# EAGLE schematic CanarySchematic3.0 (EAGLE 8.4.1)
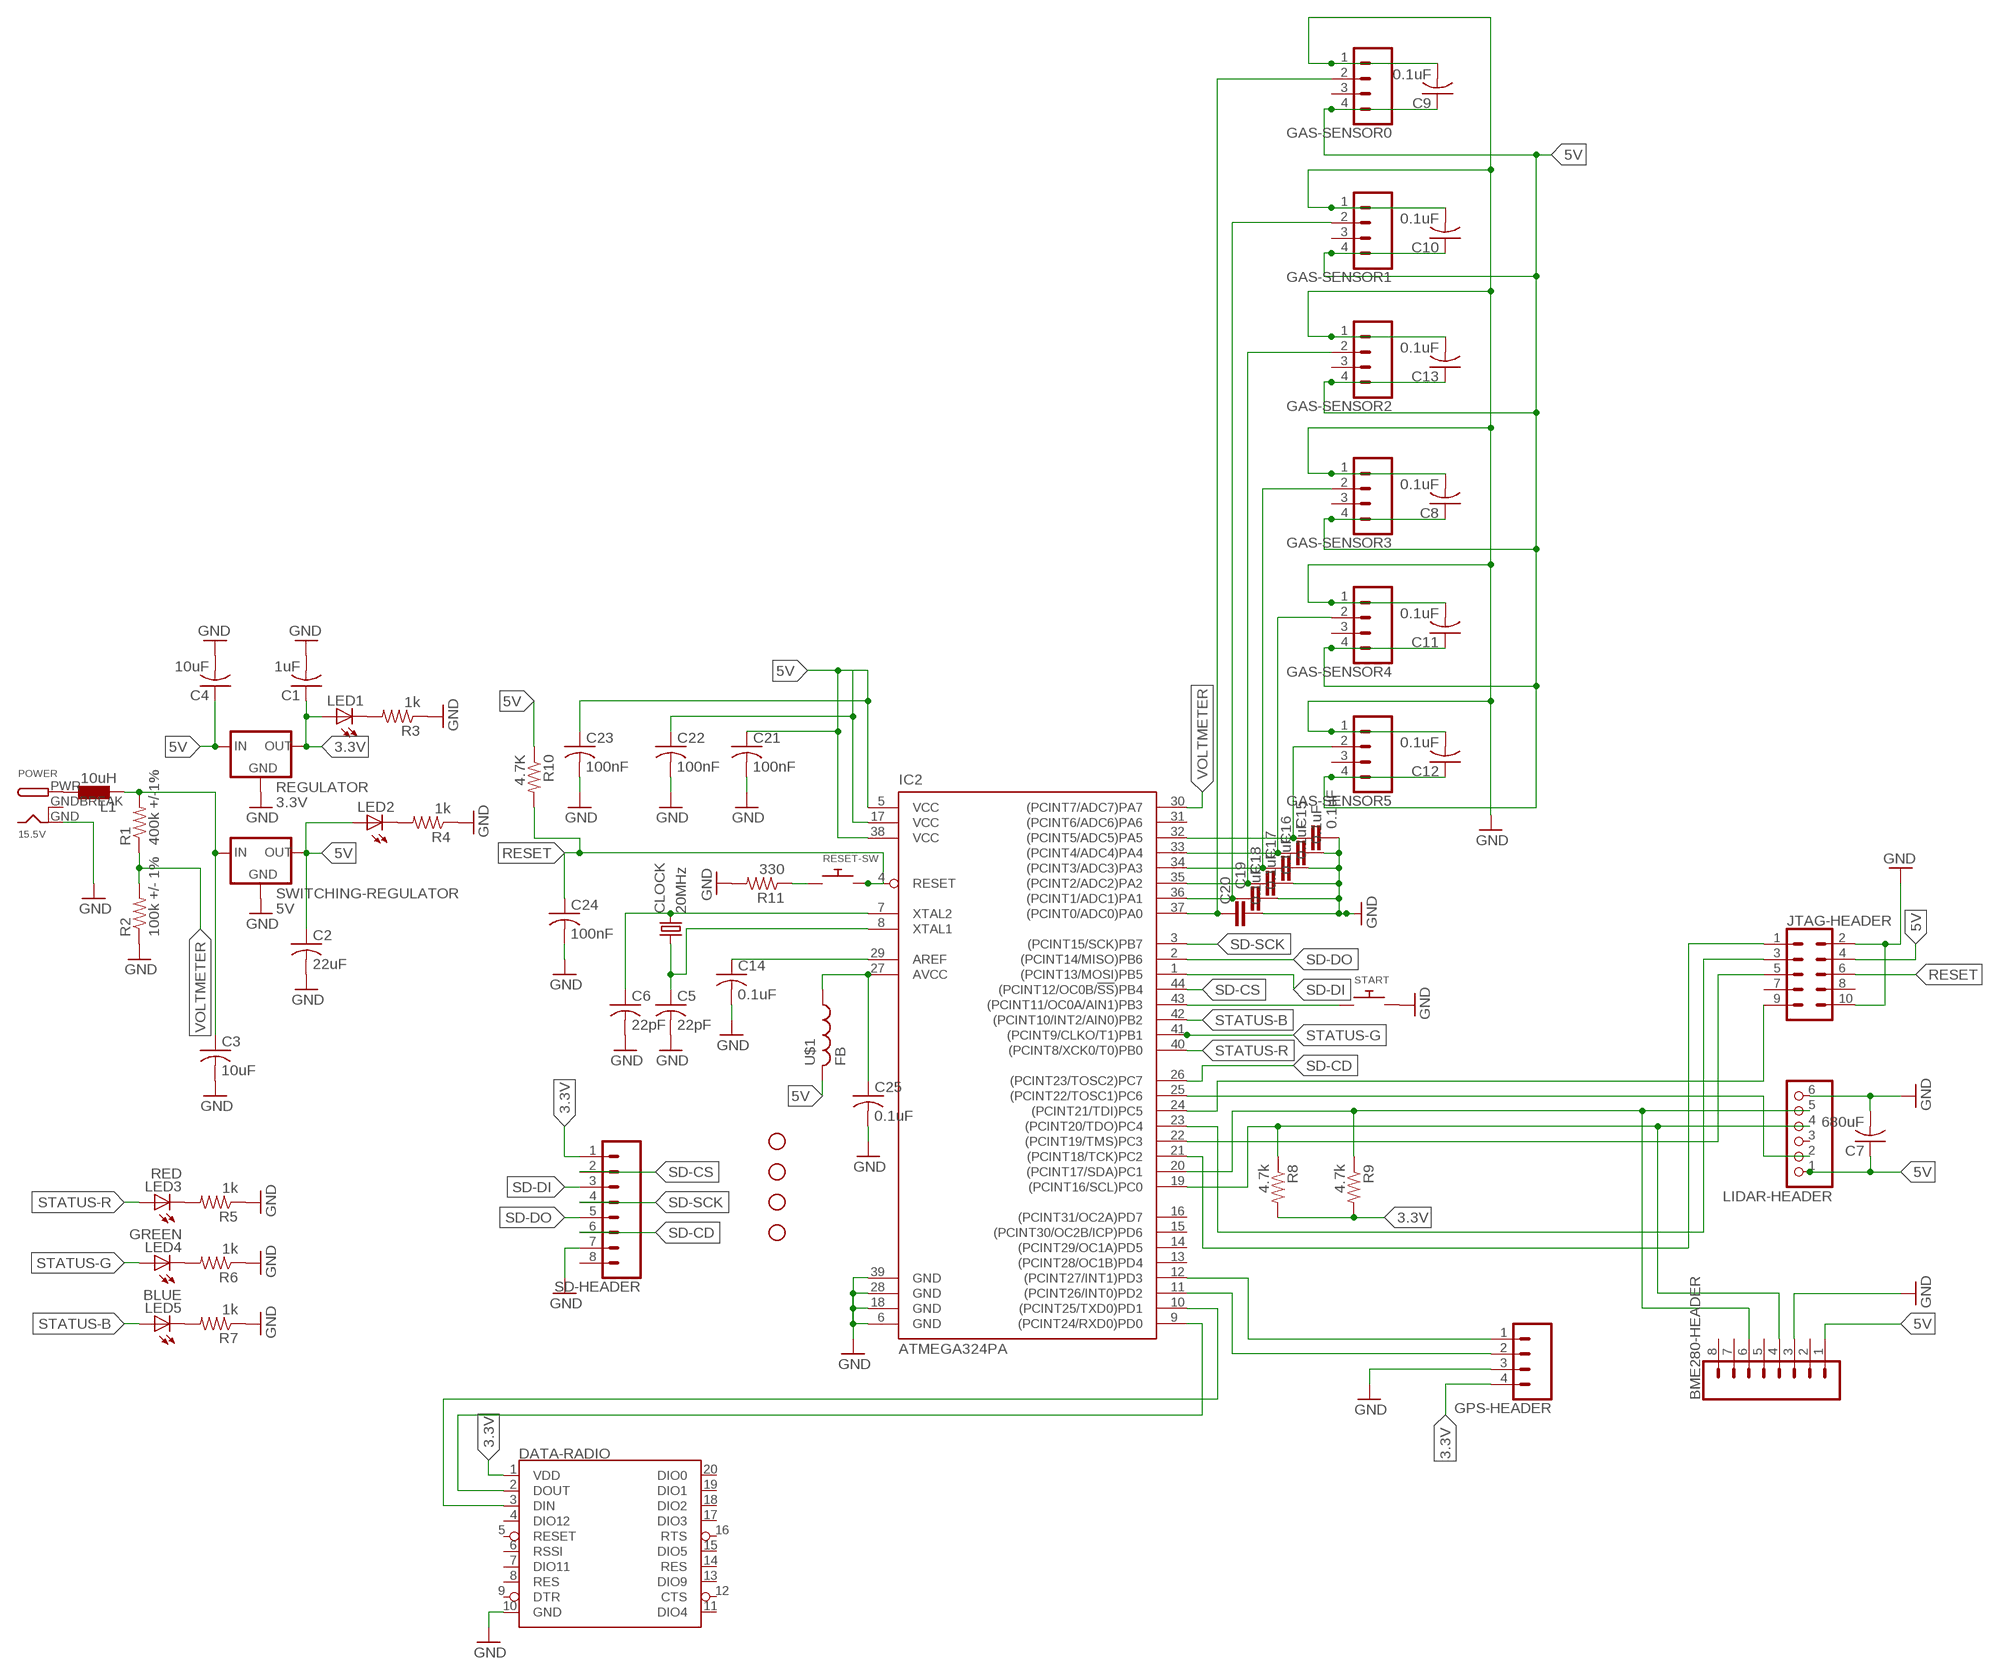
[diagram p0: schematic, sheet 1]

## Parts
BME280-HEADER  CONN_08"  [1X08]
C1  1uF  C-USC0805  [C0805]
C2  22uF  C-USC0805  [C0805]
C3  10uF  C-USC0805  [C0805]
C4  10uF  C-USC0805  [C0805]
C5  22pF  C-USC0805  [C0805]
C6  22pF  C-USC0805  [C0805]
C7  680uF  C-USC0805  [C0805]
C8  0.1uF  C-USC0805  [C0805]
C9  0.1uF  C-USC0805  [C0805]
C10  0.1uF  C-USC0805  [C0805]
C11  0.1uF  C-USC0805  [C0805]
C12  0.1uF  C-USC0805  [C0805]
C13  0.1uF  C-USC0805  [C0805]
C14  0.1uF  C-USC0805  [C0805]
C15  0.1uF  CC0504  [C0504]
C16  0.1uF  CC0504  [C0504]
C17  0.1uF  CC0504  [C0504]
C18  0.1uF  CC0504  [C0504]
C19  0.1uF  CC0504  [C0504]
C20  0.1uF  CC0504  [C0504]
C21  100nF  C-USC0805  [C0805]
C22  100nF  C-USC0805  [C0805]
C23  100nF  C-USC0805  [C0805]
C24  100nF  C-USC0805  [C0805]
C25  0.1uF  C-USC0805  [C0805]
CLOCK  20MHz  CRYSTAL68SMX  [86SMX]
DATA-RADIO  XBEE  [XBEE]
GAS-SENSOR0  CONN_04  [1X04]
GAS-SENSOR1  CONN_04  [1X04]
GAS-SENSOR2  CONN_04  [1X04]
GAS-SENSOR3  CONN_04  [1X04]
GAS-SENSOR4  CONN_04  [1X04]
GAS-SENSOR5  CONN_04  [1X04]
GPS-HEADER  CONN_04  [1X04]
H8  STAND-OFF  [STAND-OFF]
IC2  ATMEGA324PA  ATMEGA644A  [TQFP44]
JTAG-HEADER  CONN_05X2PTH  [2X5]
L1  10uH  L  [L1812]
LED1  LEDCHIP-LED0805  [CHIP-LED0805]
LED2  LEDCHIP-LED0805  [CHIP-LED0805]
LED3  RED  LEDCHIP-LED0805  [CHIP-LED0805]
LED4  GREEN  LEDCHIP-LED0805  [CHIP-LED0805]
LED5  BLUE  LEDCHIP-LED0805  [CHIP-LED0805]
LIDAR-HEADER  PINHD-1X6  [1X06]
MOUNT-HOLE1  STAND-OFF  [STAND-OFF]
MOUNT-HOLE2  STAND-OFF  [STAND-OFF]
MOUNT-HOLE3  STAND-OFF  [STAND-OFF]
POWER  15.5V  DCBARRELPTH  [DCJACK_2MM_PTH]
R1  400k +/-1%  R-US_M0805  [M0805]
R2  100k +/- 1%  R-US_M0805  [M0805]
R3  1k  R-US_M0805  [M0805]
R4  1k  R-US_M0805  [M0805]
R5  1k  R-US_M0805  [M0805]
R6  1k  R-US_M0805  [M0805]
R7  1k  R-US_M0805  [M0805]
R8  4.7k  R-US_M0805  [M0805]
R9  4.7k  R-US_M0805  [M0805]
R10  4.7K  R-US_M0805  [M0805]
R11  330  R-US_M0805  [M0805]
REGULATOR  3.3V  V_REG_78XXSINK  [TO220-IGO]
RESET-SW  SWITCH_PUSHBUTTONSOFTTOUCHSMD_SJ  [PUSHBUTTON_SMD_SJ]
SD-HEADER  CONN_08"  [1X08]
START  SWITCH_PUSHBUTTONSOFTTOUCHSMD_SJ  [PUSHBUTTON_SMD_SJ]
SWITCHING-REGULATOR  5V  V_REG_78XXSINK  [TO220-IGO]
U$1  FB  [FB]

## Nets
3.3V: C1.1 DATA-RADIO.1(VDD) GPS-HEADER.4 LED1.A R8.2 R9.2 REGULATOR.OUT SD-HEADER.1
5V: BME280-HEADER.1 C2.1 C4.1 C7.1 C8.1 C9.1 C10.1 C11.1 C12.1 C13.1 C25.1 GAS-SENSOR0.4 GAS-SENSOR1.4 GAS-SENSOR2.4 GAS-SENSOR3.4 GAS-SENSOR4.4 GAS-SENSOR5.4 IC2.27(AVCC) JTAG-HEADER.4 LED2.A LIDAR-HEADER.1 REGULATOR.IN SWITCHING-REGULATOR.OUT U$1.P$1
GND: BME280-HEADER.3 C1.2 C2.2 C3.2 C4.2 C5.2 C6.2 C7.2 C8.2 C9.2 C10.2 C11.2 C12.2 C13.2 C14.2 C15.2 C16.2 C17.2 C18.2 C19.2 C20.2 C21.2 C22.2 C23.2 C24.2 C25.2 DATA-RADIO.10(GND) GAS-SENSOR0.1 GAS-SENSOR1.1 GAS-SENSOR2.1 GAS-SENSOR3.1 GAS-SENSOR4.1 GAS-SENSOR5.1 GPS-HEADER.3 IC2.6(GND) IC2.18(GND) IC2.28(GND) IC2.39(GND) JTAG-HEADER.2 JTAG-HEADER.10 LIDAR-HEADER.6 POWER.GND R2.1 R3.1 R4.1 R5.1 R6.1 R7.1 R11.2 REGULATOR.GND SD-HEADER.7 START.P$2 SWITCHING-REGULATOR.GND
N$1: C3.1 L1.2 R1.2 SWITCHING-REGULATOR.IN
N$2: LED1.C R3.2
N$3: LED2.C R4.2
N$4: LED3.C R5.2
N$5: LED4.C R6.2
N$6: LED5.C R7.2
N$7: IC2.43((PCINT11/OC0A/AIN1)PB3) START.P$1
N$8: C6.1 CLOCK.4 IC2.7(XTAL2)
N$9: U$1.P$2
N$10: GPS-HEADER.1 IC2.12((PCINT27/INT1)PD3)
N$11: GPS-HEADER.2 IC2.11((PCINT26/INT0)PD2)
N$12: C20.1 GAS-SENSOR0.2 IC2.37((PCINT0/ADC0)PA0)
N$13: IC2.25((PCINT22/TOSC1)PC6) LIDAR-HEADER.2
N$14: IC2.24((PCINT21/TDI)PC5) JTAG-HEADER.9
N$15: C14.1 IC2.29(AREF)
N$16: C19.1 GAS-SENSOR1.2 IC2.36((PCINT1/ADC1)PA1)
N$17: C18.1 GAS-SENSOR2.2 IC2.35((PCINT2/ADC2)PA2)
N$18: C17.1 GAS-SENSOR3.2 IC2.34((PCINT3/ADC3)PA3)
N$19: C16.1 GAS-SENSOR4.2 IC2.33((PCINT4/ADC4)PA4)
N$20: C15.1 GAS-SENSOR5.2 IC2.32((PCINT5/ADC5)PA5)
N$21: BME280-HEADER.4 IC2.19((PCINT16/SCL)PC0) LIDAR-HEADER.4 R8.1
N$22: L1.1 POWER.PWR
N$23: IC2.23((PCINT20/TDO)PC4) JTAG-HEADER.3
N$24: BME280-HEADER.6 IC2.20((PCINT17/SDA)PC1) LIDAR-HEADER.5 R9.1
N$25: IC2.22((PCINT19/TMS)PC3) JTAG-HEADER.5
N$26: DATA-RADIO.3(DIN) IC2.10((PCINT25/TXD0)PD1)
N$27: DATA-RADIO.2(DOUT) IC2.9((PCINT24/RXD0)PD0)
N$28: IC2.21((PCINT18/TCK)PC2) JTAG-HEADER.1
N$29: C21.1 C22.1 C23.1 IC2.5(VCC) IC2.17(VCC) IC2.38(VCC)
N$30: R11.1 RESET-SW.P$1
N$31: R10.1
N$32: C5.1 CLOCK.1 IC2.8(XTAL1)
RESET: C24.1 IC2.4(RESET) JTAG-HEADER.6 R10.2 RESET-SW.P$2
SD-CD: IC2.26((PCINT23/TOSC2)PC7) SD-HEADER.6
SD-CS: IC2.44((PCINT12/OC0B/!SS!)PB4) SD-HEADER.2
SD-DI: IC2.1((PCINT13/MOSI)PB5) SD-HEADER.3
SD-DO: IC2.2((PCINT14/MISO)PB6) SD-HEADER.5
SD-SCK: IC2.3((PCINT15/SCK)PB7) SD-HEADER.4
STATUS-B: IC2.42((PCINT10/INT2/AIN0)PB2) LED5.A
STATUS-G: IC2.41((PCINT9/CLKO/T1)PB1) LED4.A
STATUS-R: IC2.40((PCINT8/XCK0/T0)PB0) LED3.A
VOLTMETER: IC2.30((PCINT7/ADC7)PA7) R1.1 R2.2
Unconnected: BME280-HEADER.2 BME280-HEADER.5 BME280-HEADER.7 BME280-HEADER.8 DATA-RADIO.4(DIO12) DATA-RADIO.5(RESET) DATA-RADIO.6(RSSI) DATA-RADIO.7(DIO11) DATA-RADIO.8(RES) DATA-RADIO.9(DTR) DATA-RADIO.11(DIO4) DATA-RADIO.12(CTS) DATA-RADIO.13(DIO9) DATA-RADIO.14(RES) DATA-RADIO.15(DIO5) DATA-RADIO.16(RTS) DATA-RADIO.17(DIO3) DATA-RADIO.18(DIO2) DATA-RADIO.19(DIO1) DATA-RADIO.20(DIO0) GAS-SENSOR0.3 GAS-SENSOR1.3 GAS-SENSOR2.3 GAS-SENSOR3.3 GAS-SENSOR4.3 GAS-SENSOR5.3 IC2.13((PCINT28/OC1B)PD4) IC2.14((PCINT29/OC1A)PD5) IC2.15((PCINT30/OC2B/ICP)PD6) IC2.16((PCINT31/OC2A)PD7) IC2.31((PCINT6/ADC6)PA6) JTAG-HEADER.7 JTAG-HEADER.8 LIDAR-HEADER.3 SD-HEADER.8

## Power pins joined to a net without a drawn wire
GNDBREAK: POWER.GNDBREAK

## Library data of the parts
BME280-HEADER SD-HEADER = SparkFun-Connectors:CONN_08: Multi connection point. Often used as Generic Header-pin footprint for 0.1 inch spaced/style header connections On any of the 0.1 inch spaced packages, you can populate with these: Break Away Headers - Straight <https://www.sparkfun.com/products/116> (PRT-00116) Break Away Male Headers - Right Angle <https://www.sparkfun.com/products/553> (PRT-00553) Female Headers <https://www.sparkfun.com/products/115> (PRT-00115) Break Away Headers - Machine Pin <https://www.sparkfun.com/products/117> (PRT-00117) Break Away Female Headers - Swiss Machine Pin <https://www.sparkfun.com/products/743> (PRT-00743) Arduino Stackable Header - 8 Pin <https://www.sparkfun.com/products/9279> (PRT-09279) For SCREWTERMINALS and SPRING TERMINALS visit here: Screw Terimnals on SparkFun.com <https://www.sparkfun.com/search/results?term=Screw+Terminals> (5mm/3.5mm/2.54mm spacing) This device is also useful as a general connection point to wire up your design to another part of your project. Our various solder wires solder well into these plated through hole pads. Hook-Up Wire - Assortment (Stranded, 22 AWG) <https://www.sparkfun.com/products/11375> (PRT-11375) Hook-Up Wire - Assortment (Solid Core, 22 AWG) <https://www.sparkfun.com/products/11367> (PRT-11367) View the entire wire category on our website here <https://www.sparkfun.com/categories/141> Special notes: Molex polarized connector foot print use with SKU : PRT-08231 with associated crimp pins and housings. 1MM SMD Version SKU: PRT-10208 NOTES ON THE VARIANTS LOCK and LOCK_LONGPADS... This footprint was designed to help hold the alignment of a through-hole component (i.e. 6-pin header) while soldering it into place. You may notice that each hole has been shifted either up or down by 0.005 of an inch from it's more standard position (which is a perfectly straight line). This slight alteration caused the pins (the squares in the middle) to touch the edges of the holes. Because they are alternating, it causes a "brace" to hold the component in place. 0.005 has proven to be the perfect amount of "off-center" position when using our standard breakaway headers. Although looks a little odd when you look at the bare footprint, once you have a header in there, the alteration is very hard to notice. Also,if you push a header all the way into place, it is covered up entirely on the bottom side.; PROD_ID: CONN-08438
C1-C14 C21-C25 = adafruit:C-US: CAPACITOR, American symbol
C15-C20 = eagle-ltspice:C: CAPACITOR, European symbol; SPICEMODEL: NONE; SPICEPREFIX: C
CLOCK = adafruit:CRYSTAL: CRYSTAL; OC_FARNELL: 6344860; OC_NEWARK: unknown
DATA-RADIO = SparkFun-RF:XBEE: Digi XBee and XBee Pro XBees are tiny blue chips that can communicate wirelessly with each other. They can do simple things, like replacing a couple of wires in serial communication, which is nice when you want to make a remote for your paintball vehicle. SparkFun Products SparkFun XBee Buying Guide <https://www.sparkfun.com/pages/xbee_guide> SparkFun XBee Explorer USB <https://www.sparkfun.com/products/11812> (WRL-11812) Breakout Board for XBee Module <https://www.sparkfun.com/products/8276> (WRL-8276) SparkFun XBee Explorer Regulated <https://www.sparkfun.com/products/11373> (WRL-11373) SparkFun XBee Explorer Dongle <https://www.sparkfun.com/products/11697> (WRL-11697) SparkFun XBee Shield <https://www.sparkfun.com/products/12847> (WRL-12847) SparkFun XBee Explorer Serial <https://www.sparkfun.com/products/13225> (WRL-13225)
GAS-SENSOR0 GAS-SENSOR1-GAS-SENSOR5 GPS-HEADER = SparkFun-Connectors:CONN_04: Multi connection point. Often used as Generic Header-pin footprint for 0.1 inch spaced/style header connections On any of the 0.1 inch spaced packages, you can populate with these: Break Away Headers - Straight <https://www.sparkfun.com/products/116> (PRT-00116) Break Away Male Headers - Right Angle <https://www.sparkfun.com/products/553> (PRT-00553) Female Headers <https://www.sparkfun.com/products/115> (PRT-00115) Break Away Headers - Machine Pin <https://www.sparkfun.com/products/117> (PRT-00117) Break Away Female Headers - Swiss Machine Pin <https://www.sparkfun.com/products/743> (PRT-00743) For SCREWTERMINALS and SPRING TERMINALS visit here: Screw Terimnals on SparkFun.com <https://www.sparkfun.com/search/results?term=Screw+Terminals> (5mm/3.5mm/2.54mm spacing) This device is also useful as a general connection point to wire up your design to another part of your project. Our various solder wires solder well into these plated through hole pads. Hook-Up Wire - Assortment (Stranded, 22 AWG) <https://www.sparkfun.com/products/11375> (PRT-11375) Hook-Up Wire - Assortment (Solid Core, 22 AWG) <https://www.sparkfun.com/products/11367> (PRT-11367) View the entire wire category on our website here <https://www.sparkfun.com/categories/141> Special notes: Molex polarized connector foot print use with SKU : PRT-08231 with associated crimp pins and housings. 1MM SMD Version SKU: PRT-10208; PROD_ID: CONN-09696
H8 MOUNT-HOLE1-MOUNT-HOLE3 = SparkFun-Hardware:STAND-OFF: Stand Off Drill holes for mechanically mounting via screws, standoffs, etc. Note: Use the keepout ring to avoid running the screw head into surrounding components. Variant Overviews STAND-OFF - Mechanical footprint for a #4 phillips button head screw. STAND-OFF-TIGHT - Mechanical footprint for a #4 phillips button head screw, Example SparkFun Products Screw - Phillips Head (1/4", 4-40, 10 pack) <https://www.sparkfun.com/products/10453> (PRT-10453) Screw - Phillips Head (1/2", 4-40, 10 pack) <https://www.sparkfun.com/products/10452> (PRT-10452) Screw - Phillips Head (3/4", 4-40, 10 pack) <https://www.sparkfun.com/products/10451> (PRT-10451) Screw - Phillips Head (1", 4-40, 10 pack) <https://www.sparkfun.com/products/10450> (PRT-10450)
IC2 = atmel:ATMEGA644: 8-bit Microcontroller with 64K Bytes In-System Programmable Flash Source: http://www.atmel.com/dyn/resources/prod_documents/doc2593.pdf; MPN: ATMEGA644PV-10AU; OC_FARNELL: 1455123; OC_NEWARK: 58M3748
JTAG-HEADER = SparkFun-Connectors:CONN_05X2: Multi connection point. Often used as Generic Header-pin footprint for 0.1 inch spaced/style header connections For AVR SPI programming port, see special device with nice symbol: "AVR_SPI_PROG_5x2.dev" You can populate with any combo of single row headers, but if you'd like an exact match, check these: 2x5 AVR ICSP Male Header <https://www.sparkfun.com/products/778> (PRT-00778) 2x5 Pin Shrouded Header <https://www.sparkfun.com/products/8506> (PRT-08506) On any of the 0.1 inch spaced packages, you can populate with these: Break Away Headers - Straight <https://www.sparkfun.com/products/116> (PRT-00116) Break Away Male Headers - Right Angle <https://www.sparkfun.com/products/553> (PRT-00553) Female Headers <https://www.sparkfun.com/products/115> (PRT-00115) Break Away Headers - Machine Pin <https://www.sparkfun.com/products/117> (PRT-00117) Break Away Female Headers - Swiss Machine Pin <https://www.sparkfun.com/products/743> (PRT-00743) Special note: the shrouded connector mates well with our 5x2 ribbon cables: 2x5 Pin IDC Ribbon Cable <https://www.sparkfun.com/products/8535> (PRT-08535); PROD_ID: CONN-08499; SF_ID: PRT-0778
L1 = eagle-ltspice:L: INDUCTOR, European symbol; SPICEMODEL: NONE; SPICEPREFIX: L
LED1-LED5 = adafruit:LED: LED OSRAM: - CHIPLED LG R971, LG N971, LY N971, LG Q971, LY Q971, LO R971, LY R971 LH N974, LH R974 LS Q976, LO Q976, LY Q976 LO Q996 - Hyper CHIPLED LW Q18S LB Q993, LB Q99A, LB R99A - SideLED LS A670, LO A670, LY A670, LG A670, LP A670 LB A673, LV A673, LT A673, LW A673 LH A674 LY A675 LS A676, LA A676, LO A676, LY A676, LW A676 LS A679, LY A679, LG A679 - Hyper Micro SIDELED® LS Y876, LA Y876, LO Y876, LY Y876 LT Y87S - SmartLED LW L88C, LW L88S LB L89C, LB L89S, LG L890 LS L89K, LO L89K, LY L89K LS L896, LA L896, LO L896, LY L896 - TOPLED LS T670, LO T670, LY T670, LG T670, LP T670 LSG T670, LSP T670, LSY T670, LOP T670, LYG T670 LG T671, LOG T671, LSG T671 LB T673, LV T673, LT T673, LW T673 LH T674 LS T676, LA T676, LO T676, LY T676, LB T676, LH T676, LSB T676, LW T676 LB T67C, LV T67C, LT T67C, LS T67K, LO T67K, LY T67K, LW E67C LS E67B, LA E67B, LO E67B, LY E67B, LB E67C, LV E67C, LT E67C LW T67C LS T679, LY T679, LG T679 LS T770, LO T770, LY T770, LG T770, LP T770 LB T773, LV T773, LT T773, LW T773 LH T774 LS E675, LA E675, LY E675, LS T675 LS T776, LA T776, LO T776, LY T776, LB T776 LHGB T686 LT T68C, LB T68C - Hyper Mini TOPLED® LB M676 - Mini TOPLED Santana® LG M470 LS M47K, LO M47K, LY M47K Source: http://www.osram.convergy.de/
LIDAR-HEADER = adafruit:PINHD-1X6: PIN HEADER
POWER = adafruit:DCBARREL: 2.0mm DC Barrel Jack DCJACK_2MM_PTH - Through Hole Jack (4UConnector: 05537)
R1-R11 = adafruit:R-US_: RESISTOR, American symbol
REGULATOR SWITCHING-REGULATOR = SparkFun-IC-Power:V_REG_78XX: Voltage Regulator Standard 78xx regulator. IGO (Input Ground Output). Spark Fun Electronics SKU : COM-00107
RESET-SW START = adafruit:SWITCH_PUSHBUTTON: Buttons SOFTTOUCHSMD_SJ - Soft touch temporary push button (Super Junk Akihabara) Compatible with SKPMANE010 [Mouser: 688-SKPMAN] C&K_KSS = Digikey: KSS221GLFS
U$1 = adafruit:FB: Ferrite bead Digikey #P9821BK-ND